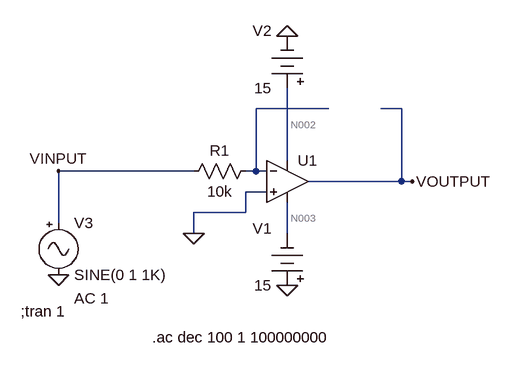
[diagram p0: schematic test02.asc]
test02.asc, the LTspice schematic file:
Version 4
SHEET 1 1248 680
WIRE 576 240 464 240
WIRE 688 240 656 240
WIRE 512 320 512 208
WIRE 368 336 160 336
WIRE 464 336 464 240
WIRE 464 336 448 336
WIRE 480 336 464 336
WIRE 688 352 688 240
WIRE 688 352 544 352
WIRE 704 352 688 352
WIRE 480 368 448 368
WIRE 448 400 448 368
WIRE 448 400 368 400
WIRE 160 416 160 336
WIRE 368 432 368 400
WIRE 512 432 512 384
FLAG 512 512 0
FLAG 512 128 0
FLAG 368 432 0
FLAG 160 496 0
FLAG 704 352 VOUTPUT
FLAG 160 336 VINPUT
SYMBOL Misc\\battery 512 528 R180
WINDOW 0 24 104 Left 2
WINDOW 3 24 16 Left 2
WINDOW 123 0 0 Left 2
WINDOW 39 0 0 Left 2
SYMATTR InstName V1
SYMATTR Value 15
SYMBOL Misc\\battery 512 224 R180
WINDOW 0 24 104 Left 2
WINDOW 3 24 16 Left 2
WINDOW 123 0 0 Left 2
WINDOW 39 0 0 Left 2
SYMATTR InstName V2
SYMATTR Value 15
SYMBOL Misc\\signal 160 400 R0
WINDOW 123 24 132 Left 2
WINDOW 39 0 0 Left 2
SYMATTR InstName V3
SYMATTR Value2 AC 1
SYMBOL Opamps\\UniversalOpamp2 512 352 R0
SYMATTR InstName U1
SYMATTR Value2 Avol=0.2Meg GBW=3Meg Slew=13Meg
SYMBOL res 464 320 R90
WINDOW 0 0 56 VBottom 2
WINDOW 3 32 56 VTop 2
SYMATTR InstName R1
SYMATTR Value 10k
TEXT 102 552 Left 2 !;tran 1
TEXT 304 592 Left 2 !.ac dec 100 1 100000000

The netlist it stands for:
* test02.asc
V1 0 N003 15
V2 N002 0 15
V3 VINPUT 0 SINE(0 1 1K) AC 1
XU1 0 N001 N002 N003 VOUTPUT level.2 Avol=0.2Meg GBW=3Meg Slew=13Meg ilimit=25m rail=0 Vos=0 phimargin=45 en=0 enk=0 in=0 ink=0 Rin=500Meg  ; pins IN+ IN- V+ V- OUT
R1 N001 VINPUT 10k
;tran 1
.ac dec 100 1 100000000
.lib UniversalOpamps2.sub
.backanno
.end

* Results of the author's LTspice run, read from the files saved beside the schematic
* Operating Point, zero values left out:
*   V(n003) = -15 V
*   V(n002) = 15 V
*   I(V2) = -1.498 mA
*   I(V1) = -1.498 mA
*   Ix(u1:3) = 1.498 mA
*   Ix(u1:4) = -1.498 mA
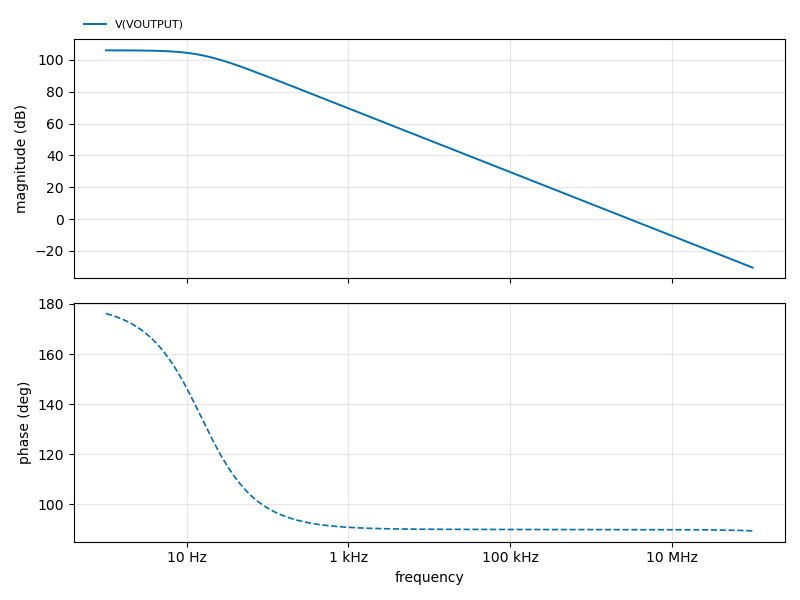
[diagram p1: AC Analysis of test02.asc, plotted from the saved traces]
* AC Analysis, 1 run:
*   V(VOUTPUT): 105.99 dB at 1 Hz, -30.47 dB at 100 MHz, peak 105.99 dB at 1 Hz, 3 dB below the peak at 15.07 Hz